# EAGLE schematic MMIRRecSys (EAGLE 7.2.0)
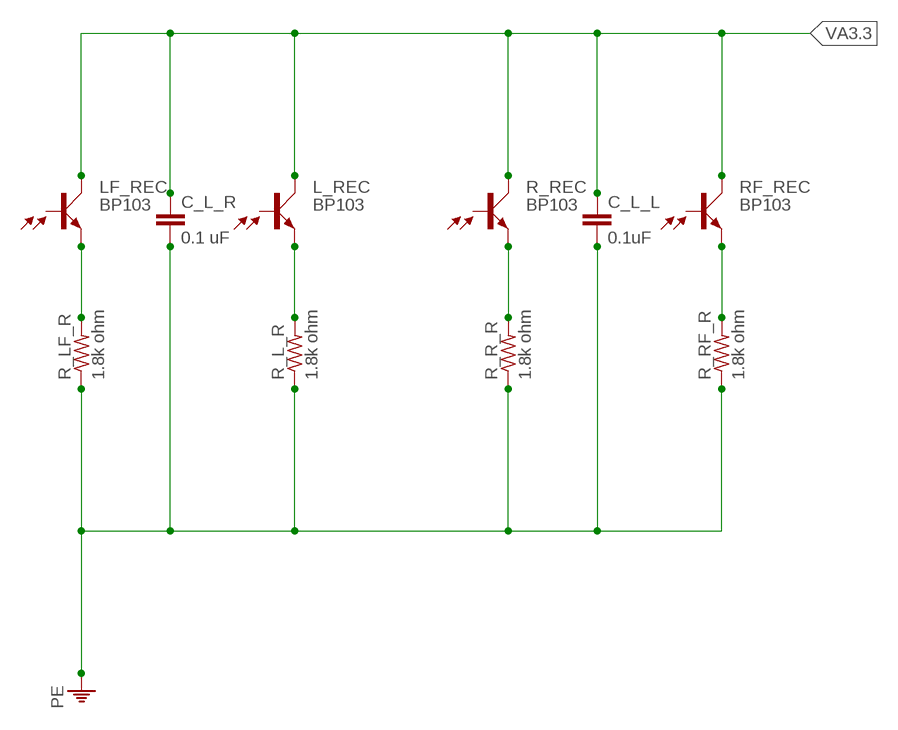
[diagram p0: schematic, sheet 1]

## Parts
C_L_L  0.1uF  C-EUC1206  [C1206]
C_L_R  0.1 uF  C-EUC1206  [C1206]
L_REC  BP103  [BP103]
LF_REC  BP103  [BP103]
R_L_R  1.8k ohm  R-US_R1206  [R1206]
R_LF_R  1.8k ohm  R-US_R1206  [R1206]
R_R_R  1.8k ohm  R-US_R1206  [R1206]
R_REC  BP103  [BP103]
R_RF_R  1.8k ohm  R-US_R1206  [R1206]
RF_REC  BP103  [BP103]

## Nets
N$1: LF_REC.E R_LF_R.2
N$9: L_REC.E R_L_R.2
N$12: R_R_R.2 R_REC.E
N$17: R_RF_R.2 RF_REC.E
PE: C_L_L.2 C_L_R.2 R_L_R.1 R_LF_R.1 R_R_R.1 R_RF_R.1
VA3.3: C_L_L.1 C_L_R.1 L_REC.C LF_REC.C R_REC.C RF_REC.C
Unconnected: L_REC.B LF_REC.B R_REC.B RF_REC.B

## Library data of the parts
C_L_L C_L_R = resistor:C-EU: CAPACITOR, European symbol
L_REC LF_REC R_REC RF_REC = opto-trans-siemens:BP103: PHOTO TRANSISTOR; OC_FARNELL: unknown; OC_NEWARK: unknown
R_L_R R_LF_R R_R_R R_RF_R = resistor:R-US_: RESISTOR, American symbol